# EAGLE design PCB-Main (EAGLE 9.3.1)
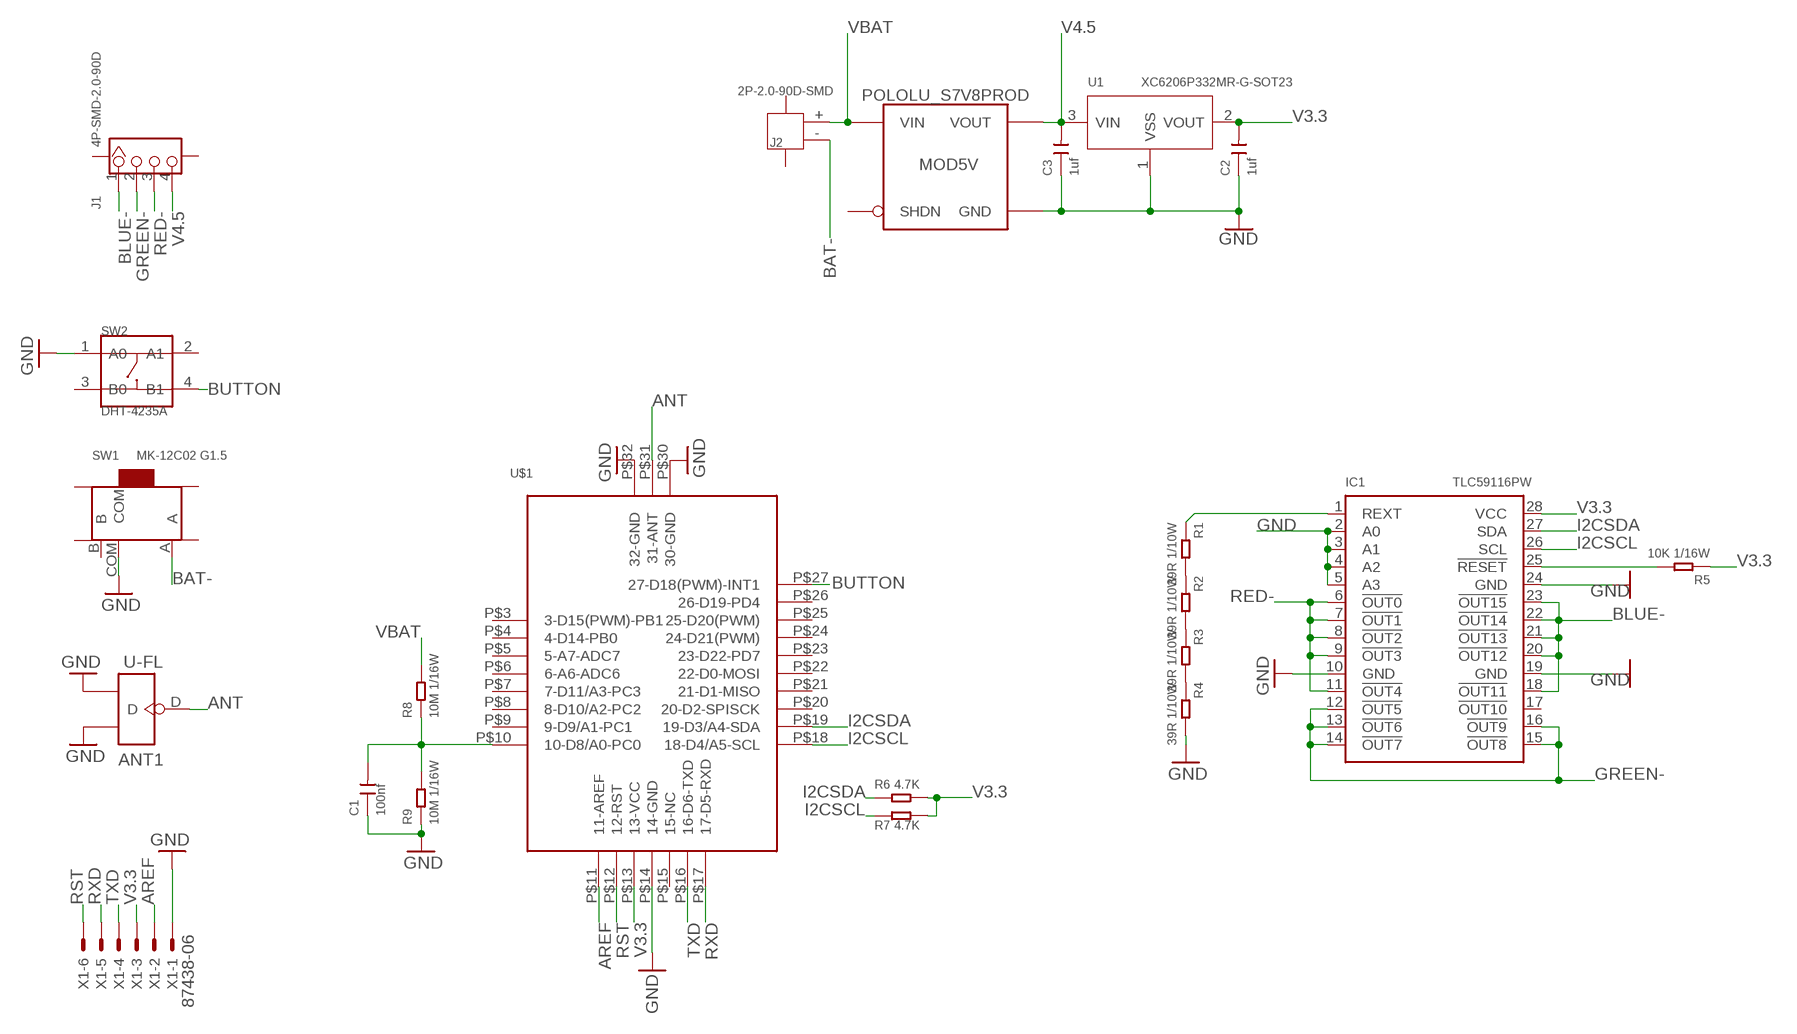
[diagram p0: schematic, sheet 1]

## Parts
ANT1  U-FL  ANTENNA-CONN-U-FL(3P)  [U-FL3P-SMD-2.6X2.6X1.0MM]
C1  100nf  CERAMIC-100NF-25V-10%-X7R(0402)  [C0402]
C2  1uf  CERAMIC-1UF-10V-10%-X5R(0402)  [C0402]
C3  1uf  CERAMIC-1UF-10V-10%-X5R(0402)  [C0402]
IC1  TLC59116PW  [PW_R-PDSO-G28]
J1  4P-SMD-2.0-90D  GROVE-CONNECTOR-SMD-90D(4+2P-2.0)  [HW4-SMD-2.0-90D]
J2  2P-2.0-90D-SMD  CONN-HEADER-SMD-PH-SIDE-(2P-2.0MM)  [HW2-SMD-2.0-90D]
MOD5V  POLOLU_S7V8PROD  [POLOLU_4P_SIGO]
R1  39R 1/10W  SMD-RES-39R-5%-1/10W(0603)  [R0603]
R2  39R 1/10W  SMD-RES-39R-5%-1/10W(0603)  [R0603]
R3  39R 1/10W  SMD-RES-39R-5%-1/10W(0603)  [R0603]
R4  39R 1/10W  SMD-RES-39R-5%-1/10W(0603)  [R0603]
R5  10K 1/16W  SMD-RES-10K-1%-1/16W(0402)  [R0402]
R6  4.7K  SMD-RES-4.7K-5%-1/16W(0402)  [R0402]
R7  4.7K  SMD-RES-4.7K-5%-1/16W(0402)  [R0402]
R8  10M 1/16W  SMD-RES-10M-1%-1/16W(0402)  [R0402]
R9  10M 1/16W  SMD-RES-10M-1%-1/16W(0402)  [R0402]
SW1  MK-12C02 G1.5  SMD-TOGGLE-SWITCH-ON-ON(3+4P-6.7X2.7MM)  [SW7-SMD-L6.7X2.7X3.2MM]
SW2  DHT-4235A  SMD-BUTTON-TOP-DHT-4235A(4P-4.2X3.2MM)  [SW4-SMD-4.2X3.2X2.5MM]
U1  XC6206P332MR-G-SOT23  PMIC-LDO-XC6206P332MR-G(SOT23)  [SOT-23]
U$1  PANSTAMP-AVR-2  [SMD-PAD-34]
X1  87438-06  [87438-06]

## Nets
ANT: ANT1.D U$1.P$31(31-ANT)
AREF: U$1.P$11(11-AREF) X1.2
BAT-: J2.- SW1.A
BLUE-: IC1.18(!OUT11) IC1.20(!OUT12) IC1.21(!OUT13) IC1.22(!OUT14) IC1.23(!OUT15) J1.1
BUTTON: SW2.4(B1) U$1.P$27(27-D18(PWM)-INT1)
GND: ANT1.GND1 ANT1.GND2 C1.1 C2.1 C3.1 IC1.2(A0) IC1.3(A1) IC1.4(A2) IC1.5(A3) IC1.10(GND) IC1.19(GND) IC1.24(GND) MOD5V.G(GND) R4.2 R9.1 SW1.COM SW2.1(A0) U1.1(VSS) U$1.P$14(14-GND) U$1.P$30(30-GND) U$1.P$32(32-GND) X1.1
GREEN-: IC1.12(!OUT5) IC1.13(!OUT6) IC1.14(!OUT7) IC1.15(!OUT8) IC1.16(!OUT9) J1.2
I2CSCL: IC1.26(SCL) R7.1 U$1.P$18(18-D4/A5-SCL)
I2CSDA: IC1.27(SDA) R6.1 U$1.P$19(19-D3/A4-SDA)
N$2: R1.2 R2.1
N$3: R2.2 R3.1
N$4: R3.2 R4.1
N$7: IC1.25(!RESET) R5.2
N$9: IC1.1(REXT) R1.1
N$17: C1.2 R8.1 R9.2 U$1.P$10(10-D8/A0-PC0)
RED-: IC1.6(!OUT0) IC1.7(!OUT1) IC1.8(!OUT2) IC1.9(!OUT3) IC1.11(!OUT4) J1.3
RST: U$1.P$12(12-RST) X1.6
RXD: U$1.P$17(17-D5-RXD) X1.5
TXD: U$1.P$16(16-D6-TXD) X1.4
V3.3: C2.2 IC1.28(VCC) R5.1 R6.2 R7.2 U1.2(VOUT) U$1.P$13(13-VCC) X1.3
V4.5: C3.2 J1.4 MOD5V.O(VOUT) U1.3(VIN)
VBAT: J2.+ MOD5V.I(VIN) R8.2
Unconnected: IC1.17(!OUT10) J1.SS1 J1.SS2 J2.3 J2.4 MOD5V.S(SHDN) SW1.B SW1.SS1 SW1.SS2 SW1.SS3 SW1.SS4 SW2.2(A1) SW2.3(B0) U$1.P$3(3-D15(PWM)-PB1) U$1.P$4(4-D14-PB0) U$1.P$5(5-A7-ADC7) U$1.P$6(6-A6-ADC6) U$1.P$7(7-D11/A3-PC3) U$1.P$8(8-D10/A2-PC2) U$1.P$9(9-D9/A1-PC1) U$1.P$15(15-NC) U$1.P$20(20-D2-SPISCK) U$1.P$21(21-D1-MISO) U$1.P$22(22-D0-MOSI) U$1.P$23(23-D22-PD7) U$1.P$24(24-D21(PWM)) U$1.P$25(25-D20(PWM)) U$1.P$26(26-D19-PD4)

## Library data of the parts
ANT1 = Seeed-Connector:ANTENNA-CONN-U-FL(3P): 320110048
C1 = Seeed-Capacitor:CERAMIC-100NF-25V-10%-X7R(0402): 302010024; MPN: CC0402KRX7R8BB104
C2 C3 = Seeed-Capacitor:CERAMIC-1UF-10V-10%-X5R(0402): 302010040; MPN: CC0402KRX5R6BB105
IC1 = Components:TLC59116: 16-CHANNEL Fm+ I2C-BUS CONSTANT-CURRENT LED SINK DRIVER Author: RobG
J1 = Seeed-Connector:GROVE-CONNECTOR-SMD-90D(4+2P-2.0): 320110032
J2 = Seeed-Connector:CONN-HEADER-SMD-PH-SIDE-(2P-2.0MM): 320110026
MOD5V = Components:POLOLU_S7V8: Pololu Adjustable Step Up/Down Voltage Regulators REG09B 0.4"x0.6" SOURCE www.pololu.com/ PACKAGE THT; 4-pin (0.1"); 0.4"x0.6"
R1-R4 = Seeed-Resistor:SMD-RES-39R-5%-1/10W(0603): 301010138; MPN: RC0603JR-0739RL
R5 = Seeed-Resistor:SMD-RES-10K-1%-1/16W(0402): 301010047; MPN: RC0402FR-0710KL
R6 R7 = Seeed-Resistor:SMD-RES-4.7K-5%-1/16W(0402): 301010010; MPN: RC0402JR-074K7L
R8 R9 = Seeed-Resistor:SMD-RES-10M-1%-1/16W(0402): 301010509; MPN: RC0402FR-0710ML
SW1 = Seeed-Switch:SMD-TOGGLE-SWITCH-ON-ON(3+4P-6.7X2.7MM): 311030001; MPN: MK-12C02 G1.5
SW2 = Seeed-Switch:SMD-BUTTON-TOP-DHT-4235A(4P-4.2X3.2MM): 311020045; MPN: DHT-4235A
U1 = Seeed-IC:PMIC-LDO-XC6206P332MR-G(SOT23): 310030099; MPN: XC6206P332MR-G
U$1 = Components:PANSTAMP-AVR-2
X1 = Components:87438-06: Wire-to-Board 1.50mm (.059") Pitch Header - Right Angle, SMT, Shrouded Source: http://www.molex.com/product/micro/87438.html; MPN: 87438-0643; OC_FARNELL: 1756938; OC_NEWARK: 88K3155

## Board
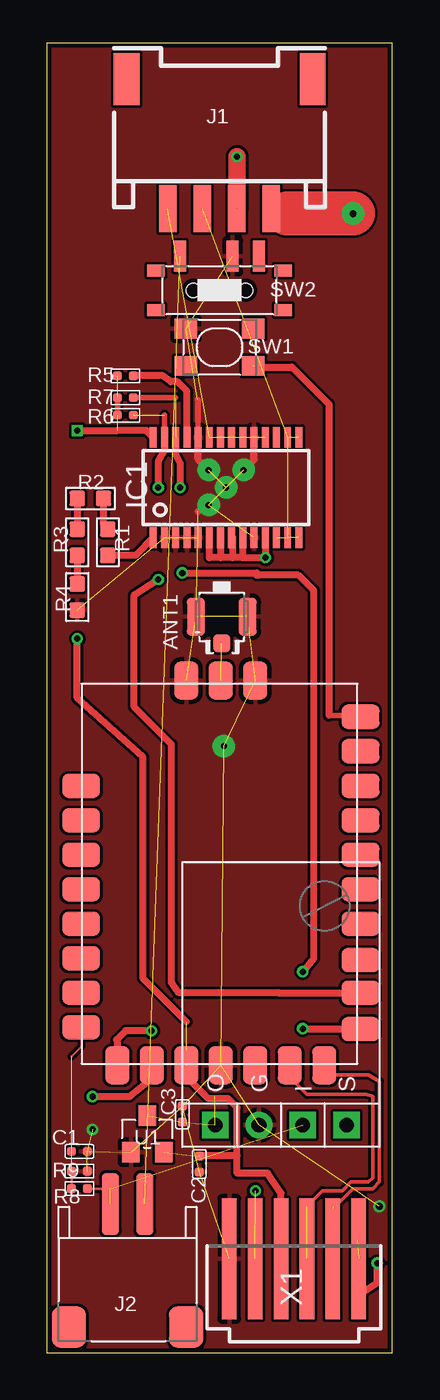
[diagram p1: board, top side]
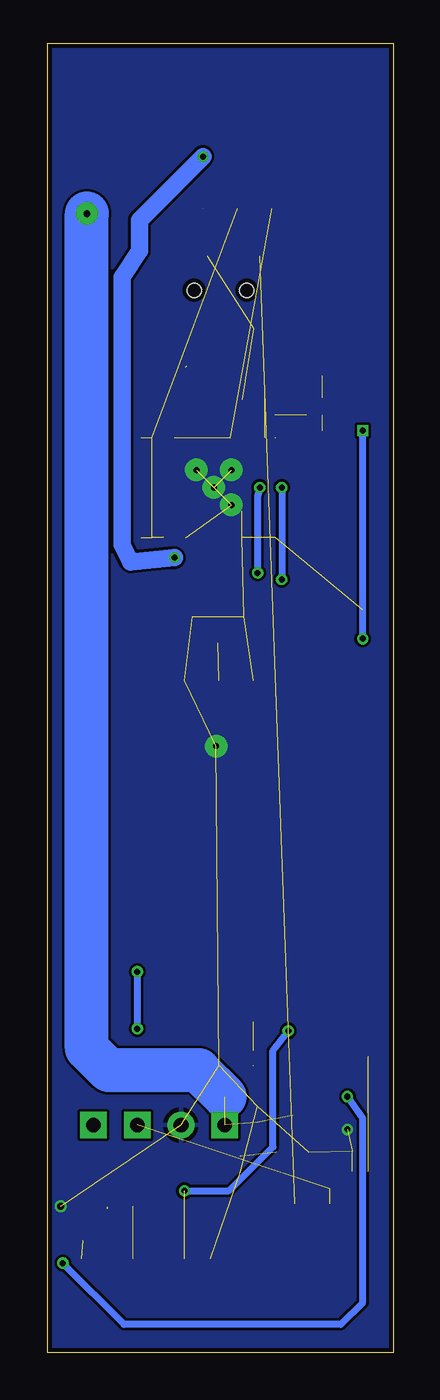
[diagram p2: board, bottom side, seen from below]

Size 20.07 x 75.92 mm. Coordinates in mm from the lower left corner, seen from the top.
Outline: 0,0 20.07,0 20.07,75.92 0,75.92 0,0
Copper layers (1*16): Top 0.035mm / dielectric 1.5mm / Bottom 0.035mm
Design rules "SeeedStudio_2layer_DRU_no_angle_20140221": minimum track width 6mil, minimum drill 12mil, track to track 6mil, track to pad 6mil, pad to pad 6mil, via to via 6mil, smd to smd 0mil, copper to edge 10mil, drill to drill 10mil, minimum pad ring 10mil, minimum via ring 6mil, stop-mask expansion 2mil, vias tented up to drill 100mil, thermal gap 10mil

### Footprints (pad centres in the part's own frame; a part is rotated, then mirrored left to right if it is on the bottom)
U-FL3P-SMD-2.6X2.6X1.0MM = smd 1.05 x 1: D -1.524,0 | smd 2.2 x 1.05: GND1 0,1.5; GND2 0,-1.5
C0402 = smd 0.5 x 0.5: 1 0,0.463; 2 0,-0.463
PW_R-PDSO-G28 = smd 0.4 x 1.2: 1 -4.225,-2.9; 2 -3.575,-2.9; 3 -2.925,-2.9; 4 -2.275,-2.9; 5 -1.625,-2.9; 6 -0.975,-2.9; 7 -0.325,-2.9; 8 0.325,-2.9; 9 0.975,-2.9; 10 1.625,-2.9; 11 2.275,-2.9; 12 2.925,-2.9; 13 3.575,-2.9; 14 4.225,-2.9; 15 4.225,2.9; 16 3.575,2.9; 17 2.925,2.9; 18 2.275,2.9; 19 1.625,2.9; 20 0.975,2.9; 21 0.325,2.9; 22 -0.325,2.9; 23 -0.975,2.9; 24 -1.625,2.9; 25 -2.275,2.9; 26 -2.925,2.9; 27 -3.575,2.9; 28 -4.225,2.9
HW4-SMD-2.0-90D = smd 1.01 x 2.74: 1 -3,-0.1; 2 -1,-0.1; 3 1,-0.1; 4 3,-0.1 | smd 1.5 x 3: SS1 -5.4,7.4; SS2 5.4,7.4
HW2-SMD-2.0-90D = smd 2 x 2.4: 3 3.4,-2.181; 4 -3.4,-2.181 | smd 1 x 3.6: + -1,4.953; - 1,4.953
POLOLU_4P_SIGO = drill 0.85 pad 1.549: G -1.27,-8.89 | drill 0.85 pad 1.549 square: I 1.27,-8.89; O -3.81,-8.89; S 3.81,-8.89
R0603 = smd 0.889 x 0.889: 1 0,0.762; 2 0,-0.762
R0402 = smd 0.5 x 0.5: 1 0,0.463; 2 0,-0.463
SW7-SMD-L6.7X2.7X3.2MM = smd 1.8 x 0.7: A 1.978,2.286; B 1.978,-2.286; COM 1.978,-0.762 | smd 0.7 x 1.016: SS1 -1.15,-3.683; SS2 1.15,-3.683; SS3 1.15,3.683; SS4 -1.15,3.683 | hole 0.813: 0,-1.524; 0,1.524
SW4-SMD-4.2X3.2X2.5MM = smd 1.3 x 1.15: 1 -1.95,1.075; 2 1.95,1.075; 3 -1.95,-1.075; 4 1.95,-1.075
SOT-23 = smd 1.016 x 1.2: 1 -0.95,-1.06; 2 0.95,-1.06; 3 0,1.06
SMD-PAD-34 = smd 2.2 x 1.4: P$3 -0.026,16.111; P$4 -0.026,14.111; P$5 -0.026,12.111; P$6 -0.026,10.111; P$7 -0.026,8.111; P$8 -0.026,6.111; P$9 -0.026,4.111; P$10 -0.026,2.111; P$18 16.174,2.011; P$19 16.174,4.111; P$20 16.174,6.011; P$21 16.174,8.111; P$22 16.174,10.111; P$23 16.174,12.111; P$24 16.174,14.111; P$25 16.174,16.111; P$26 16.174,18.111; P$27 16.174,20.111 | smd 1.4 x 2.2: P$11 2.074,-0.089; P$12 4.074,-0.089; P$13 6.074,-0.089; P$14 8.074,-0.089; P$15 10.074,-0.089; P$16 12.074,-0.089; P$17 14.074,-0.089; P$30 10.074,22.211; P$31 8.074,22.211; P$32 6.074,22.211
87438-06 = smd 7 x 0.85: 1 0,3.75; 2 0,2.25; 3 0,0.75; 4 0,-0.75; 5 0,-2.25; 6 0,-3.75

### Placement (x,y rotation side)
ANT1  10.16,42.67 90 top
C1  1.91,11.68 270 top
C2  8.86,10.95 180 top
C3  7.87,13.84 0 top
IC1  10.41,50.16 0 top
J1  10.03,66.42 0 top
J2  4.7,3.68 0 top
MOD5V  13.59,22.1 0 top
R1  3.56,46.99 180 top
R2  2.54,49.53 270 top
R3  1.78,46.99 0 top
R4  1.78,43.81 0 top
R5  4.57,56.64 90 top
R6  4.57,54.36 270 top
R7  4.57,55.37 270 top
R8  1.91,9.53 90 top
R9  1.91,10.54 270 top
SW1  10.03,61.59 90 top
SW2  10.03,58.29 0 top
U1  5.84,12.7 0 top
U$1  2.03,16.76 0 top
X1  14.35,5.46 90 top

### Tracks (layer width: path | path; a pad name or v marks a point on that pad's centre or on a via)
ANT  (1 unrouted)
AREF  (via drill 0.35)  (1 unrouted)
  Top 0.406: v6.1,18.67 4.57,18.67 4.06,18.16 4.11,18.12 U$1.P$11
  Bottom 0.406: v6.1,18.67 6.99,17.53 6.99,11.94 9.53,9.4 v12.12,9.4
BAT-  (1 unrouted)
BLUE-  (5 unrouted)
BUTTON  (1 unrouted)
  Top 0.305: 16.38,36.96 18.21,36.96 U$1.P$27
  Top 0.406: 12.05,57.15 14.22,57.15 16.38,54.99 16.38,36.96
GND  (via drill 0.35, 0.35 pad 1.3, 0.4)  (26 unrouted)
  Top 0.305: IC1.24 8.79,55.22 8.76,55.24
  Top 0.406: IC1.19 12.04,51.79 v11.43,51.18 | 8.79,48.79 v9.4,49.15 | IC1.24 8.79,51.79 v9.4,51.18
  other vias: 2.67,12.95 10.41,50.16 10.29,35.18 19.3,8.51
  pour Top (isolate 0.152): 0,0 20.07,0 20.07,75.95 0,75.95
  pour Bottom (isolate 0.152): 0,0 20.07,0 20.07,75.95 0,75.95
GREEN-  (5 unrouted)
I2CSCL  (via drill 0.35)  (2 unrouted)
  Top 0.305: R7.1 7.49,55.37
  Top 0.406: IC1.26 7.49,52.07 7.75,51.56 v7.75,50.16 | v14.86,18.8 15.13,18.77 U$1.P$18 | v14.86,22.1 15.49,22.86 15.49,44.2 14.61,45.09 12.32,45.09 | 12.32,45.09 12.19,45.09 | v7.87,45.21 12.19,45.21 12.32,45.09
  Bottom 0.406: v7.75,50.16 7.87,49.66 v7.87,45.21 | v14.86,22.1 v14.86,18.8
I2CSDA  (via drill 0.35)  (2 unrouted)
  Top 0.152: 13.8,20.87 13.46,20.88
  Top 0.305: 6.86,54.36 6.86,53.05
  Top 0.406: 6.86,53.05 6.86,52.32 6.48,51.69 v6.48,50.16 | U$1.P$19 13.46,20.88 7.67,20.88 7.24,21.46 7.24,35.27 5.08,37.43 5.08,43.94 v6.48,44.83
  Bottom 0.406: v6.48,50.16 v6.48,44.83
N$2
  Top 0.406: R1.2 3.3,48.01 R2.1
N$3
  Top 0.406: R2.2 R3.1
N$4
  Top 0.406: R3.2 R4.1
N$7
  Top 0.406: IC1.25 8.14,55.74 7.59,56.29 7.21,56.29 6.73,56.64 R5.2
N$9
  Top 0.406: IC1.1 5.15,46.23 R1.1
N$17  (2 unrouted)
  Top 0.152: R8.1 R9.2 | 1.44,17.19 2.03,17.78 2.03,18.85 U$1.P$10
RED-  (via drill 0.35)  (1 unrouted)
  Top 0.406: IC1.11 v12.7,46.1 11.37,46.1 | 10.79,46.1 10.1,46.1 | 11.37,46.1 10.79,46.1 | 10.1,46.1 9.44,46.1 IC1.6 | IC1.7 10.1,46.1 | IC1.8 10.79,47.27 10.79,46.1 | IC1.9 11.37,47.27 11.37,46.1
  Top 1.016: v11.05,69.34 11.05,66.34
  Bottom 1.016: v12.7,46.1 15.24,45.85 15.75,46.86 15.75,62.36 14.73,63.88 14.73,65.66 v11.05,69.34
RST  (via drill 0.35)  (1 unrouted)
  Top 0.406: 18.03,6.54 18.03,3.3 19.18,4.06 v19.18,5.21 | 6.1,16.66 U$1.P$12 6.11,15.88 4.83,14.86 v2.67,14.86
  Bottom 0.406: v2.67,14.86 1.78,13.59 1.78,2.92 3.05,1.65 15.62,1.65 v19.18,5.21
RXD  (1 unrouted)
  Top 0.203: U$1.P$17 16.65,16.13 18.67,16.13 19.3,15.75 19.3,9.91 18.92,9.53 17.78,9.53 16.6,8.35 | X1.5 16.6,8.47
  Top 0.406: 16.47,16.18 U$1.P$17 | X1.5 16.51,6.57 16.51,4.45
TXD  (1 unrouted)
  Top 0.203: 13.97,16.26 13.97,16.13 15.11,14.99 18.54,14.99 18.92,14.86 18.92,10.16 18.67,9.91 17.65,9.91 17.14,9.4 16,9.4 15.1,8.5
  Top 0.406: 13.97,15.88 13.97,16.26 13.97,16.54 U$1.P$16
V3.3  (via drill 0.35)  (6 unrouted)
  Top 0.305: R6.2 R7.2
  Top 0.406: v1.78,41.4 1.78,37.97 5.59,34.54 5.59,21.72 8.11,19.2 | v1.78,53.47 4.11,53.47 5.79,53.47 IC1.28 | U$1.P$13 8.13,16.68 8.13,17.53 | 13.46,6.62 X1.3 13.6,9.26 12.83,10.41 11.05,10.41 11.05,11.43 | 11.05,11.43 11.05,14.22 10.54,14.73 9.4,14.73 8.13,16 8.13,16.65 | 11.05,11.43 8.88,11.43
  Bottom 0.406: v1.78,41.4 v1.78,53.47
V4.5  (via drill 0.4 pad 1.3)  (3 unrouted)
  Top 0.406: 13.97,66.04 13.31,66.04 J1.4
  Top 2.54: v17.78,66.04 13.97,66.04
  Bottom 2.54: 9.78,14.86 11.3,16.38 16.51,16.38 17.78,17.65 v17.78,66.04
VBAT  (2 unrouted)
  Top 0.152: R8.2 3.7,9.53